# Altium schematic sheet Top Sheet.SchDoc
size A4; DrawnBy: JimBobJones; DocumentNumber: 1; SheetNumber: 1; SheetTotal: 4
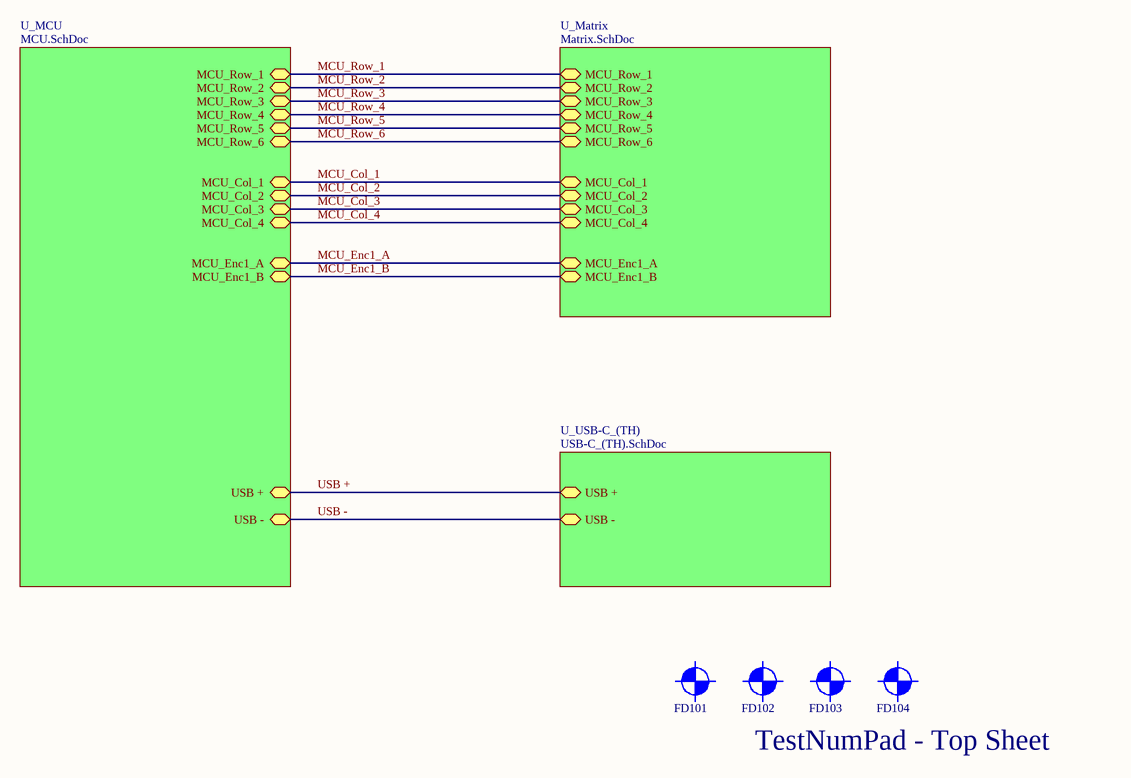
[diagram p0: Top Sheet.SchDoc]

## Parts
FD101  Fiducial  [Fiducial]  (value not drawn)  (no BOM)
FD102  Fiducial  [Fiducial]  (value not drawn)  (no BOM)
FD103  Fiducial  [Fiducial]  (value not drawn)  (no BOM)
FD104  Fiducial  [Fiducial]  (value not drawn)  (no BOM)

## Sub-sheets
U_Matrix = Matrix.SchDoc: MCU_Row_1 (bidir), MCU_Row_2 (bidir), MCU_Row_3 (bidir), MCU_Row_4 (bidir), MCU_Row_5 (bidir), MCU_Row_6 (bidir), MCU_Col_1 (bidir), MCU_Col_2 (bidir), MCU_Col_3 (bidir), MCU_Col_4 (bidir), MCU_Enc1_A (bidir), MCU_Enc1_B (bidir)
U_MCU = MCU.SchDoc: MCU_Row_1 (bidir), MCU_Row_2 (bidir), MCU_Row_3 (bidir), MCU_Row_4 (bidir), MCU_Row_5 (bidir), MCU_Row_6 (bidir), MCU_Col_1 (bidir), MCU_Col_2 (bidir), MCU_Col_3 (bidir), MCU_Col_4 (bidir), MCU_Enc1_A (bidir), MCU_Enc1_B (bidir), USB - (bidir), USB + (bidir)
U_USB-C_(TH) = USB-C_(TH).SchDoc: USB - (bidir), USB + (bidir)

## Nets
MCU_Col_1: sheet U_MCU/MCU_Col_1, sheet U_Matrix/MCU_Col_1
MCU_Col_2: sheet U_MCU/MCU_Col_2, sheet U_Matrix/MCU_Col_2
MCU_Col_3: sheet U_MCU/MCU_Col_3, sheet U_Matrix/MCU_Col_3
MCU_Col_4: sheet U_MCU/MCU_Col_4, sheet U_Matrix/MCU_Col_4
MCU_Enc1_A: sheet U_MCU/MCU_Enc1_A, sheet U_Matrix/MCU_Enc1_A
MCU_Enc1_B: sheet U_MCU/MCU_Enc1_B, sheet U_Matrix/MCU_Enc1_B
MCU_Row_1: sheet U_MCU/MCU_Row_1, sheet U_Matrix/MCU_Row_1
MCU_Row_2: sheet U_MCU/MCU_Row_2, sheet U_Matrix/MCU_Row_2
MCU_Row_3: sheet U_MCU/MCU_Row_3, sheet U_Matrix/MCU_Row_3
MCU_Row_4: sheet U_MCU/MCU_Row_4, sheet U_Matrix/MCU_Row_4
MCU_Row_5: sheet U_MCU/MCU_Row_5, sheet U_Matrix/MCU_Row_5
MCU_Row_6: sheet U_MCU/MCU_Row_6, sheet U_Matrix/MCU_Row_6
USB +: sheet U_MCU/USB +, sheet U_USB-C_(TH)/USB +
USB -: sheet U_MCU/USB -, sheet U_USB-C_(TH)/USB -

## Notes on the sheet
- TestNumPad - Top Sheet

## Library data of the parts
FD101-FD104 = Fiducial: Fiducial Mark